# EAGLE design Board (EAGLE 9.6.2)
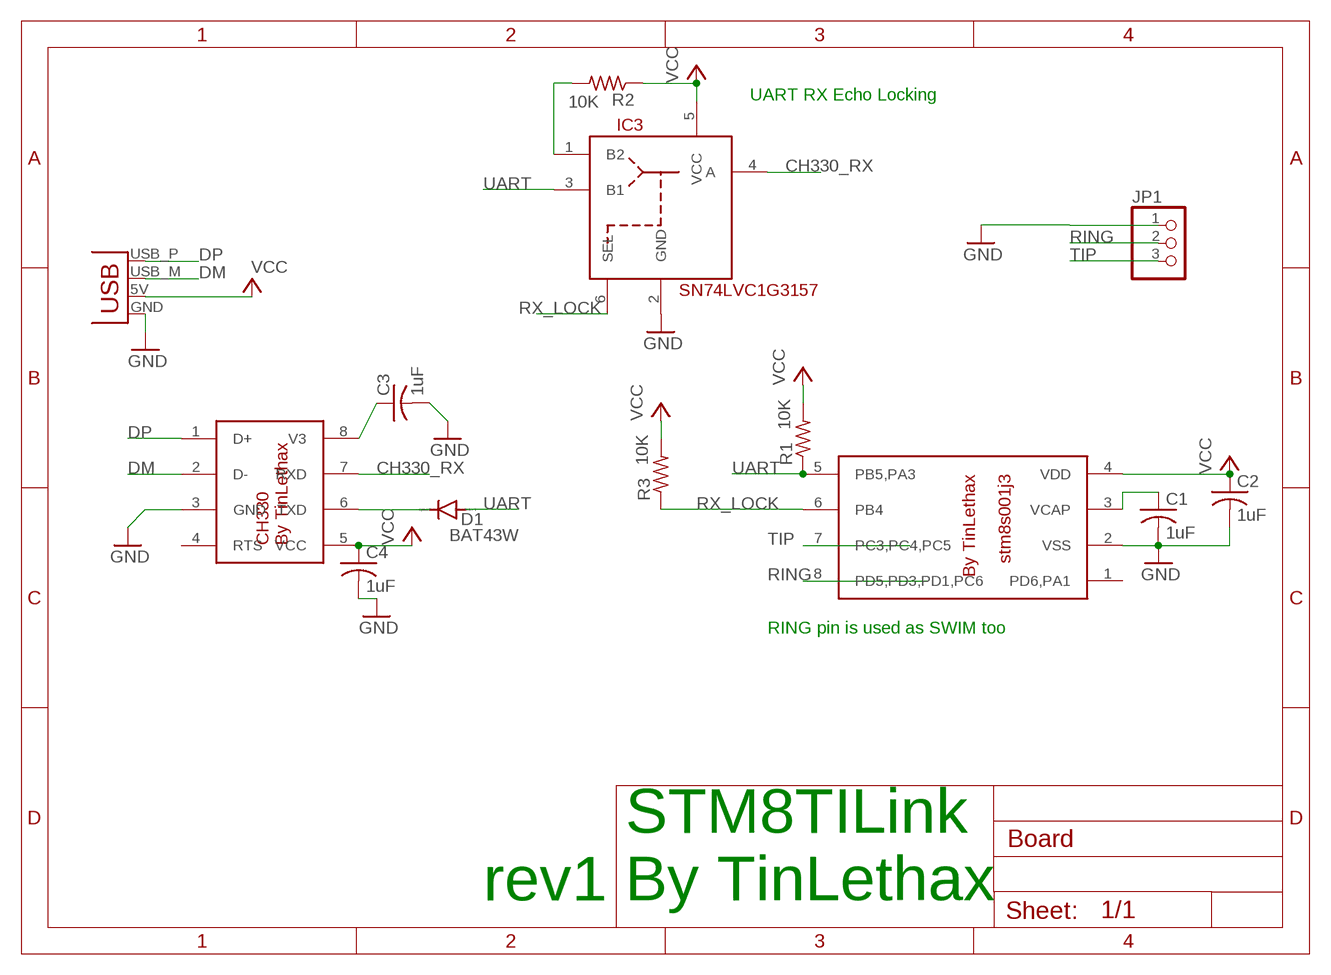
[diagram p0: schematic, sheet 1]

## Parts
C1  1uF  C-USC0603  [C0603]
C2  1uF  C-USC0603  [C0603]
C3  1uF  C-USC0603  [C0603]
C4  1uF  C-USC0603  [C0603]
D1  BAT43W  CGRM400-G  [SOD-123_MINI-SMA]
IC1  STM8S001J3  [SOP8]
IC2  CH330  [SOIC127P600X150-8N]
IC3  SN74LVC1G3157  [SOT95P280X145-6N]
JP1  PINHD-1X3  [1X03]
R1  10K  R-US_R0603  [R0603]
R2  10K  R-US_R0603  [R0603]
R3  10K  R-US_R0603  [R0603]
X1  USB_USBPCB  [USB_USB-A-PCB]

## Nets
CH330_RX: IC2.7(RXD) IC3.4(A)
DM: IC2.2(D-) X1.USB_M(D-)
DP: IC2.1(D+) X1.USB_P(D+)
GND: C1.2 C2.2 C3.2 C4.2 IC1.2(VSS) IC2.3(GND) IC3.2(GND) JP1.1 X1.GND
N$1: C1.1 IC1.3(VCAP)
N$2: IC3.1(B2) R2.2
N$3: C3.1 IC2.8(V3)
N$4: D1.C IC2.6(TXD)
RING: IC1.8(PD5,PD3,PD1,PC6) JP1.2
RX_LOCK: IC1.6(PB4) IC3.6(SEL) R3.1
TIP: IC1.7(PC3,PC4,PC5) JP1.3
UART: D1.A IC1.5(PB5,PA3) IC3.3(B1) R1.1
VCC: C2.1 C4.1 IC1.4(VDD) IC2.5(VCC) IC3.5(VCC) R1.2 R2.1 R3.2 X1.5V(VBUS)
Unconnected: IC1.1(PD6,PA1) IC2.4(RTS)

## Notes on the sheet
- UART RX Echo Locking
- RING pin is used as SWIM too
- rev1
- STM8TILink
  By TinLethax

## Library data of the parts
C1-C4 = adafruit:C-US: CAPACITOR, American symbol
D1 = diode:CGRM400*-G: Molded plasitc,JEDEC SOD-123/Mini SMA Source: Comchip CGRM4001-G.pdf
IC1 = stm8s001j3:STM8S001J3
IC2 = CH330:CH330: CH330 Super small Serial to USB chip; DESCRIPTION: CH330 Super small Serial to USB chip; PACKAGE: SOP8; PARTNO: CH330
IC3 = SN74LVC1G3157:SN74LVC1G3157: This single channel single-pole double-throw (SPDT) analog switch is designed for 1.65-V to 5.5-V VCC operation. The SN74LVC1G3157 device can handle both analog and digital signals. The SN74LVC1G3157 device permits signals with amplitudes of up to VCC (peak) to be transmitted in either direction. Applications include signal gating, chopping, modulation or demodulation (modem), and signal multiplexing for analog-to-digital and digital-to-analog conversion systems.
JP1 = adafruit:PINHD-1X3: PIN HEADER
R1-R3 = adafruit:R-US_: RESISTOR, American symbol
X1 = USB:USB_USB: USB Connectors USB-B-PTH is fully proven SKU : PRT-00139 USB-miniB is fully proven SKU : PRT-00587 USB-A-PCB is untested. USB-A-H is throughly reviewed, but untested. Spark Fun Electronics SKU : PRT-00437 USB-B-SMT is throughly reviewed, but untested. Needs silkscreen touching up. USB-A-S has not been used/tested USB-MB-H has not been used/tested

## Board
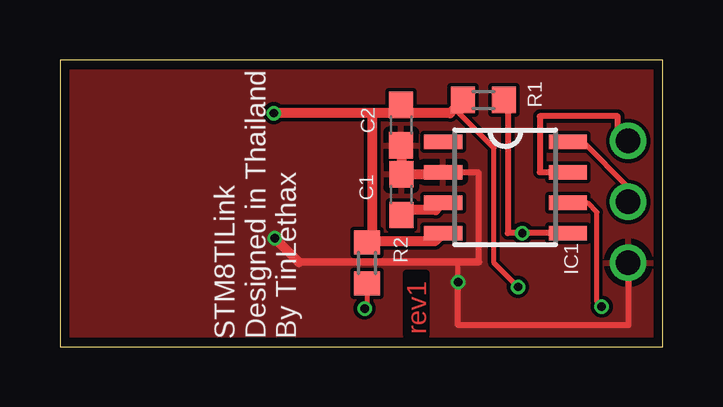
[diagram p1: board, top side]
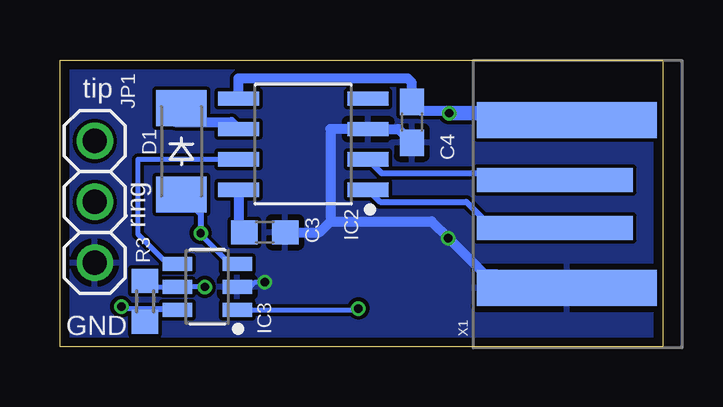
[diagram p2: board, bottom side, seen from below]

Size 25.14 x 11.97 mm. Coordinates in mm from the lower left corner, seen from the top.
Outline: 0,0 25.14,0 25.14,11.97 0,11.97 0,0
Copper layers (1*16): Top 0.035559375mm / dielectric 1.6mm / Bottom 0.035559375mm
Design rules "oshpark-2layer": minimum track width 6mil, minimum drill 10mil, track to track 6mil, track to pad 6mil, pad to pad 6mil, via to via 6mil, smd to smd 6mil, copper to edge 15mil, drill to drill 6mil, minimum pad ring 5mil, minimum via ring 5mil, stop-mask expansion 2.5mil, vias tented up to drill 0mil, thermal gap 10mil

### Footprints (pad centres in the part's own frame; a part is rotated, then mirrored left to right if it is on the bottom)
C0603 = smd 1.1 x 1: 1 -0.85,0; 2 0.85,0
SOD-123_MINI-SMA = smd 1.5 x 2.1: A 1.8,0; C -1.8,0
SOP8 = smd 0.6 x 1.6: 1 -1.905,-2.6; 2 -0.635,-2.6; 3 0.635,-2.6; 4 1.905,-2.6; 5 1.905,2.6; 6 0.635,2.6; 7 -0.635,2.6; 8 -1.905,2.6
SOIC127P600X150-8N = smd 1.708 x 0.602: 1 -2.7,1.905; 2 -2.7,0.635; 3 -2.7,-0.635; 4 -2.7,-1.905; 5 2.7,-1.905; 6 2.7,-0.635; 7 2.7,0.635; 8 2.7,1.905
SOT95P280X145-6N = smd 1.216 x 0.584: 1 -1.25,0.95; 2 -1.25,0; 3 -1.25,-0.95; 4 1.25,-0.95; 5 1.25,0; 6 1.25,0.95
1X03 = drill 1.016: 1 -2.54,0; 2 0,0; 3 2.54,0
R0603 = smd 1 x 1.1: 1 -0.85,0; 2 0.85,0
USB_USB-A-PCB = smd 7.5 x 1.5: 5V -0.2,-3.5; GND -0.2,3.5 | smd 6.5 x 1: USB_M 0.3,-1; USB_P 0.3,1

### Placement (x,y rotation side)
C1  14.23,6.35 90 top
C2  14.22,9.25 270 top
C3  16.6,4.77 0 bottom
C4  10.47,9.37 270 bottom
D1  20.08,8.15 270 bottom
IC1  18.57,6.65 270 top
IC2  15,8.45 180 bottom
IC3  19,2.5 180 bottom
JP1  23.7,6.05 90 bottom
R1  17.66,10.29 180 top
R2  12.8,3.5 270 top
R3  21.6,1.9 90 bottom
X1  4.21,5.95 180 bottom

### Tracks (layer width: path | path; a pad name or v marks a point on that pad's centre or on a via)
CH330_RX
  Bottom 0.2: IC2.7 21.88,7.81 21.9,7.8 21.9,4.7 20.65,3.45 IC3.4
DM
  Bottom 0.254: IC2.2 11.74,7.25 4.81,7.25 X1.USB_M
DP
  Bottom 0.254: X1.USB_P 7.11,4.95 8.2,6.04 11.8,6.04 IC2.1
GND  (via drill 0.35)
  Top 0.203: v16.6,2.7 16.6,3.54
  Top 0.254: JP1.1 23.7,0.9 16.6,0.9 v16.6,2.7 | IC1.2 17.45,7.28 17.45,3.54
  Top 0.305: 9.96,3.54 16.6,3.54 17.45,3.54
  Top 0.406: C2.2 C1.2 15.97,7.2 IC1.2 | 9.96,3.54 v8.96,4.54
  Bottom 0.203: IC3.2 17.2,2.5 17,2.7 v16.6,2.7
  Bottom 0.406: 13.87,5.24 13.87,9.08 IC2.3 11.04,9.08 C4.2 | 13.87,5.24 9.66,5.24 v8.96,4.54 7.46,3.04 6.96,3.04 6.32,2.4 4.8,2.4 4.7,2.3 4.16,2.3 X1.GND | C3.2 14.33,4.77 13.87,5.24
  pour Top: 0,12 0,0 25.1,0 25.1,12
  pour Bottom: 0,0 25.1,0 25.1,12 0,12
N$1
  Top 0.406: IC1.3 15.66,5.7 14.43,5.7 C1.1
N$2  (via drill 0.35)
  Top 0.2: R2.2 12.8,1.7 v12.7,1.6
  Bottom 0.2: IC3.1 12.75,1.55 v12.7,1.6
N$3
  Bottom 0.406: IC2.8 17.7,5.02 C3.1
N$4
  Bottom 0.406: IC2.6 18,9.38 20.35,9.38 20.35,9.68 D1.C
RING
  Top 0.2: 21.79,8.55 23.7,6.65 JP1.2
  Top 0.254: IC1.8 21.79,8.55
RX_LOCK  (via drill 0.35)
  Top 0.2: IC1.6 21.98,6.01 22.39,5.61 22.39,1.88 v22.59,1.68
  Bottom 0.2: v22.59,1.68 22.59,1.6 20.3,1.6 IC3.6 21.1,1.55 R3.1
TIP
  Top 0.254: IC1.7 20.01,7.28 20.01,9.62 23.26,9.62 23.26,8.59 JP1.3
UART  (via drill 0.35)
  Top 0.254: R1.1 18.67,10.13 18.67,4.74 IC1.5 v19.28,4.74
  Bottom 0.2: v19.28,4.74 19.28,4.68 18.05,3.45 IC3.3
  Bottom 0.254: D1.A 19.28,5.55 v19.28,4.74
VCC  (via drill 0.35)
  Top 0.2: R2.1 12.85,4.4 13.02,4.4 | v19.1,2.5 18.1,3.5 18.1,8.3 16.46,9.94 | C2.1 14.22,9.75
  Top 0.406: IC1.4 15.63,4.4 13.02,4.4 13.02,9.75 v8.92,9.75 14.22,9.75 16.27,9.75 16.46,9.94 R1.2
  Bottom 0.2: v19.1,2.5 IC3.5 | 10.67,11.2 10.66,11.2
  Bottom 0.203: R3.2 21.35,2.5 IC3.5
  Bottom 0.406: v8.92,9.75 9.02,9.85 10.11,9.85 C4.1 10.47,11.02 10.66,11.2 | IC2.5 17.7,11.2 10.67,11.2
  Bottom 0.61: v8.92,9.75 4.31,9.75 X1.5V

### Text on the board
Top: rev1
bPlace: tip | ring | GND
tNames: STM8TILink / Designed in Thailand / By TinLethax